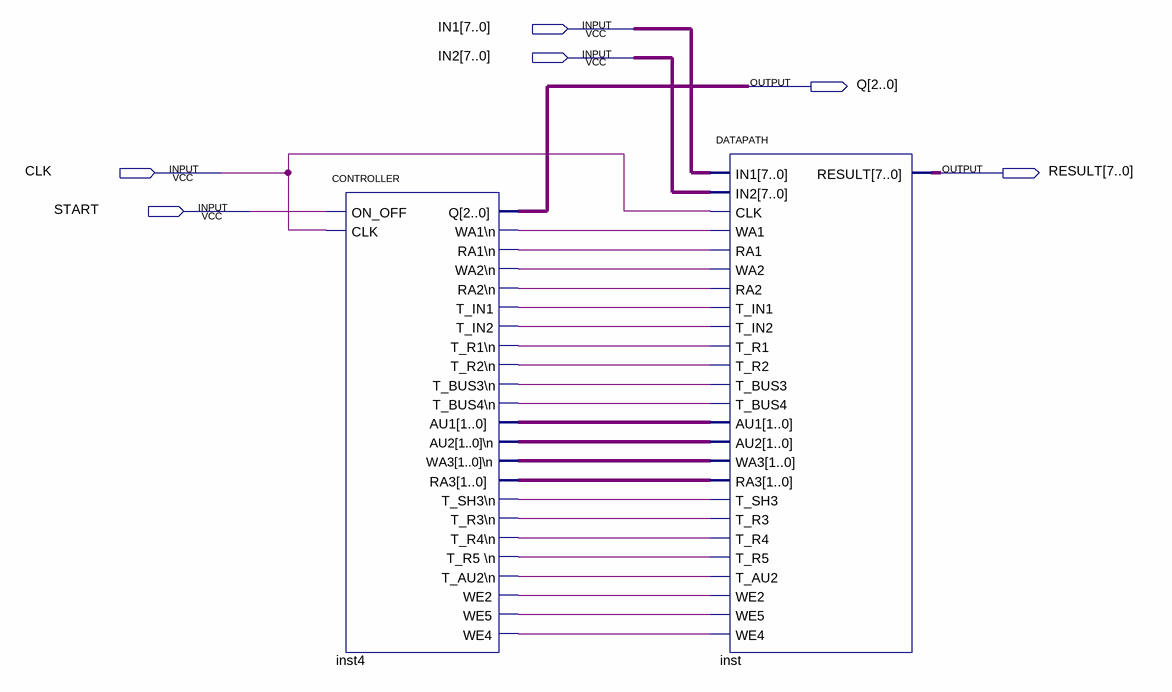
[diagram p0: schematic sheet]
// Quartus schematic PIPELINE_FINAL.bdf as structural Verilog: 2 symbols, 6 pins
module PIPELINE_FINAL (
  input  [7:0] IN1,
  input  [7:0] IN2,
  input  CLK,
  input  START,
  output [2:0] Q,
  output [7:0] RESULT
);

  wire inst4_ra1_n, inst4_ra2_n, inst4_t_au2_n, inst4_t_bus3_n, inst4_t_bus4_n, inst4_t_in1, inst4_t_in2,
       inst4_t_r1_n, inst4_t_r2_n, inst4_t_r3_n, inst4_t_r4_n, inst4_t_r5__n, inst4_t_sh3_n, inst4_wa1_n,
       inst4_wa2_n, inst4_we2, inst4_we4, inst4_we5;
  wire [1:0] inst4_au1, inst4_au2_1__0__n, inst4_ra3, inst4_wa3_1__0__n;

  CONTROLLER inst4 (
    .ON_OFF(START), .CLK(CLK), .Q(Q), .\WA1\n (inst4_wa1_n), .\RA1\n (inst4_ra1_n), .\WA2\n (inst4_wa2_n),
    .\RA2\n (inst4_ra2_n), .T_IN1(inst4_t_in1), .T_IN2(inst4_t_in2), .\T_R1\n (inst4_t_r1_n),
    .\T_R2\n (inst4_t_r2_n), .\T_BUS3\n (inst4_t_bus3_n), .\T_BUS4\n (inst4_t_bus4_n), .AU1(inst4_au1),
    .\AU2[1..0]\n (inst4_au2_1__0__n), .\WA3[1..0]\n (inst4_wa3_1__0__n), .RA3(inst4_ra3),
    .\T_SH3\n (inst4_t_sh3_n), .\T_R3\n (inst4_t_r3_n), .\T_R4\n (inst4_t_r4_n), .\T_R5_\n (inst4_t_r5__n),
    .\T_AU2\n (inst4_t_au2_n), .WE2(inst4_we2), .WE5(inst4_we5), .WE4(inst4_we4));
  DATAPATH inst (
    .IN1(IN1), .IN2(IN2), .CLK(CLK), .WA1(inst4_wa1_n), .RA1(inst4_ra1_n), .WA2(inst4_wa2_n),
    .RA2(inst4_ra2_n), .T_IN1(inst4_t_in1), .T_IN2(inst4_t_in2), .T_R1(inst4_t_r1_n), .T_R2(inst4_t_r2_n),
    .T_BUS3(inst4_t_bus3_n), .T_BUS4(inst4_t_bus4_n), .AU1(inst4_au1), .AU2(inst4_au2_1__0__n),
    .WA3(inst4_wa3_1__0__n), .RA3(inst4_ra3), .T_SH3(inst4_t_sh3_n), .T_R3(inst4_t_r3_n),
    .T_R4(inst4_t_r4_n), .T_R5(inst4_t_r5__n), .T_AU2(inst4_t_au2_n), .WE2(inst4_we2), .WE5(inst4_we5),
    .WE4(inst4_we4), .RESULT(RESULT));
endmodule
